# Altium schematic sheet DCCController.1.0.SchDoc
size A3
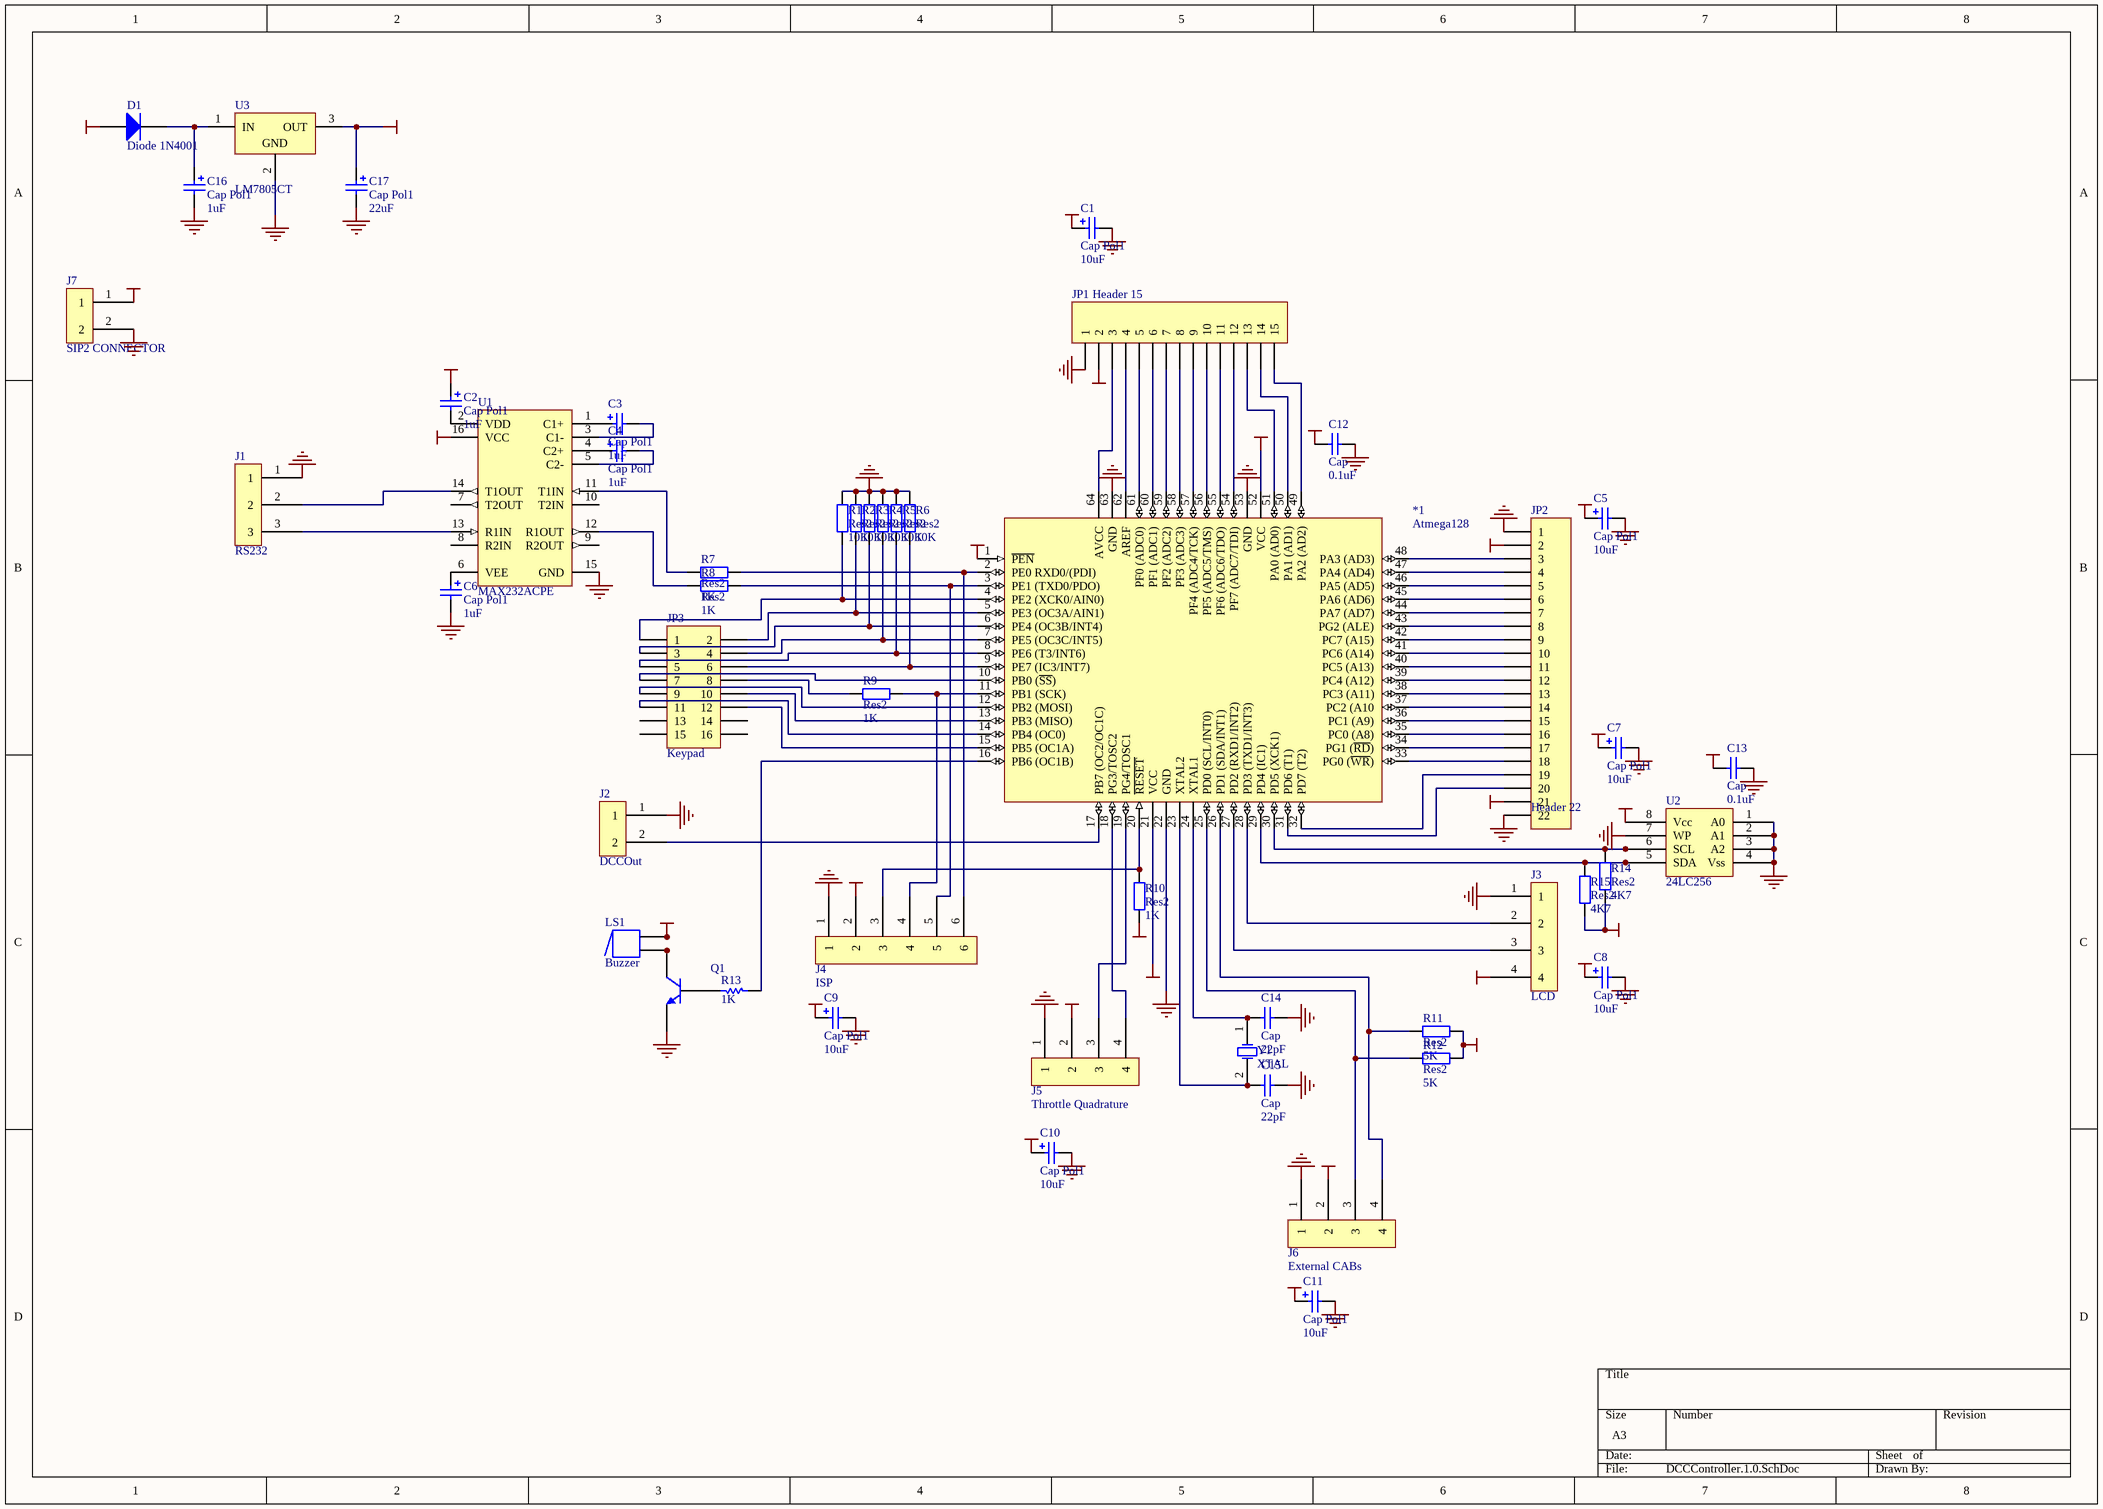
[diagram p0: DCCController.1.0.SchDoc]

## Parts
*1  Atmega128  [64A]
C1  Cap Pol1  value 10uF  [CC3216-1206]
C2  Cap Pol1  value 1uF  [CC3216-1206]
C3  Cap Pol1  value 1uF  [CC3216-1206]
C4  Cap Pol1  value 1uF  [CC3216-1206]
C5  Cap Pol1  value 10uF  [CC3216-1206]
C6  Cap Pol1  value 1uF  [CC3216-1206]
C7  Cap Pol1  value 10uF  [CC3216-1206]
C8  Cap Pol1  value 10uF  [CC3216-1206]
C9  Cap Pol1  value 10uF  [CC3216-1206]
C10  Cap Pol1  value 10uF  [CC3216-1206]
C11  Cap Pol1  value 10uF  [CC3216-1206]
C12  Cap  value 0.1uF  [RAD-0.1]
C13  Cap  value 0.1uF  [RAD-0.1]
C14  Cap  value 22pF  [CC2012-0805]
C15  Cap  value 22pF  [CC2012-0805]
C16  Cap Pol1  value 1uF  [CAPPR2-5X11]
C17  Cap Pol1  value 22uF  [CAPPR2.5-6.3X11.5]
D1  Diode 1N4001  [DIO10.46-5.3x2.8]
J1  RS232  [0.1 SIP 3 PIN]
J2  DCCOut  [0.1 SIP 2 PIN]
J3  LCD  [0.1 SIP 4 PIN]
J4  ISP  [0.1 SIP 6 PIN]
J5  Throttle Quadrature  [0.1 SIP 4 PIN]
J6  External CABs  [0.1 SIP 4 PIN]
J7  SIP2 CONNECTOR  [0.156 SIP 2 PIN]
JP1  Header 15  [HDR1X15]
JP2  Header 22  [HDR1X22]
JP3  Keypad  [HDR2X8]
LS1  Buzzer  [Mini PC Mount Piezo]
Q1  (no value)  [SO-G3]
R1  Res2  value 10K  [CR2012-0805]
R2  Res2  value 10K  [CR2012-0805]
R3  Res2  value 10K  [CR2012-0805]
R4  Res2  value 10K  [CR2012-0805]
R5  Res2  value 10K  [CR2012-0805]
R6  Res2  value 10K  [CR2012-0805]
R7  Res2  value 1K  [CR2012-0805]
R8  Res2  value 1K  [CR2012-0805]
R9  Res2  value 1K  [CR2012-0805]
R10  Res2  value 1K  [CR2012-0805]
R11  Res2  value 5K  [CR2012-0805]
R12  Res2  value 5K  [CR2012-0805]
R13  value 1K  [R2012-0805]  (hidden comment: Res1)
R14  Res2  value 4K7  [CR2012-0805]
R15  Res2  value 4K7  [CR2012-0805]
U1  MAX232ACPE  [PE16A]
U2  24LC256  [8P3]
U3  LM7805CT  [T03B]
Y1  XTAL  [Xtal Cylinder]

## Nets
GND: *1.22(GND) *1.53(GND) *1.63(GND) C1.2 C5.2 C6.2 C7.2 C8.2 C9.2 C10.2 C11.2 C12.2 C13.2 C14.2 C15.2 C16.2 C17.2 J1.1 J2.1 J3.1 J4.1 J5.1 J6.1 J7.2 JP1.1 JP2.1 JP2.22 Q1.2(E) R1.2 R2.2 R3.2 R4.2 R5.2 R6.2 U1.15(GND) U2.1(A0) U2.2(A1) U2.3(A2) U2.4(Vss) U2.7(WP) U3.2(GND)
VCC: *1.1(~{PEN}) *1.21(VCC) *1.52(VCC) C1.1 C2.1 C5.1 C7.1 C8.1 C9.1 C10.1 C11.1 C12.1 C13.1 C17.1 J3.4 J4.2 J5.2 J6.2 JP1.2 JP2.2 JP2.21 LS1.1 LS1.1A R10.1 R11.2 R12.2 R14.1 R15.1 U1.16(VCC) U2.8(Vcc) U3.3(OUT)
Vdd: D1.1(A) J7.1
Net*1_2: *1.2(PE0_RXD0/(PDI)) J4.6 R7.2
Net*1_3: *1.3(PE1_(TXD0/PDO)) J4.5 R8.2
Net*1_4: *1.4(PE2_(XCK0/AIN0)) JP3.1 R1.1
Net*1_5: *1.5(PE3_(OC3A/AIN1)) JP3.2 R2.1
Net*1_6: *1.6(PE4_(OC3B/INT4)) JP3.3 R3.1
Net*1_7: *1.7(PE5_(OC3C/INT5)) JP3.4 R4.1
Net*1_8: *1.8(PE6_(T3/INT6)) JP3.5 R5.1
Net*1_9: *1.9(PE7_(IC3/INT7)) JP3.6 R6.1
Net*1_10: *1.10(PB0_(~{SS})) JP3.7
Net*1_11: *1.11(PB1_(SCK)) J4.4 R9.2
Net*1_12: *1.12(PB2_(MOSI)) JP3.9
Net*1_13: *1.13(PB3_(MISO)) JP3.10
Net*1_14: *1.14(PB4_(OC0)) JP3.11
Net*1_15: *1.15(PB5_(OC1A)) JP3.12
Net*1_16: *1.16(PB6_(OC1B)) R13.1
Net*1_17: *1.17(PB7_(OC2/OC1C)) J2.2
Net*1_18: *1.18(PG3/TOSC2) J5.4
Net*1_19: *1.19(PG4/TOSC1) J5.3
Net*1_20: *1.20(~{RESET}) J4.3 R10.2
Net*1_23: *1.23(XTAL2) C15.1 Y1.2(OSC2)
Net*1_24: *1.24(XTAL1) C14.1 Y1.1(OSC1)
Net*1_25: *1.25(PD0_(SCL/INT0)) J6.3 R12.1
Net*1_26: *1.26(PD1_(SDA/INT1)) J6.4 R11.1
Net*1_27: *1.27(PD2_(RXD1/INT2)) J3.3
Net*1_28: *1.28(PD3_(TXD1/INT3)) J3.2
Net*1_29: *1.29(PD4_(IC1)) R15.2 U2.5(SDA)
Net*1_30: *1.30(PD5_(XCK1)) R14.2 U2.6(SCL)
Net*1_31: *1.31(PD6_(T1)) JP2.20
Net*1_32: *1.32(PD7_(T2)) JP2.19
Net*1_33: *1.33(PG0_(~{WR})) JP2.18
Net*1_34: *1.34(PG1_(~{RD})) JP2.17
Net*1_35: *1.35(PC0_(A8)) JP2.16
Net*1_36: *1.36(PC1_(A9)) JP2.15
Net*1_37: *1.37(PC2_(A10) JP2.14
Net*1_38: *1.38(PC3_(A11)) JP2.13
Net*1_39: *1.39(PC4_(A12)) JP2.12
Net*1_40: *1.40(PC5_(A13)) JP2.11
Net*1_41: *1.41(PC6_(A14)) JP2.10
Net*1_42: *1.42(PC7_(A15)) JP2.9
Net*1_43: *1.43(PG2_(ALE)) JP2.8
Net*1_44: *1.44(PA7_(AD7)) JP2.7
Net*1_45: *1.45(PA6_(AD6)) JP2.6
Net*1_46: *1.46(PA5_(AD5)) JP2.5
Net*1_47: *1.47(PA4_(AD4)) JP2.4
Net*1_48: *1.48(PA3_(AD3)) JP2.3
Net*1_49: *1.49(PA2_(AD2)) JP1.15
Net*1_50: *1.50(PA1_(AD1)) JP1.14
Net*1_51: *1.51(PA0_(AD0)) JP1.13
Net*1_54: *1.54(PF7_(ADC7/TDI)) JP1.12
Net*1_55: *1.55(PF6_(ADC6/TDO)) JP1.11
Net*1_56: *1.56(PF5_(ADC5/TMS)) JP1.10
Net*1_57: *1.57(PF4_(ADC4/TCK)) JP1.9
Net*1_58: *1.58(PF3_(ADC3)) JP1.8
Net*1_59: *1.59(PF2_(ADC2)) JP1.7
Net*1_60: *1.60(PF1_(ADC1)) JP1.6
Net*1_61: *1.61(PF0_(ADC0)) JP1.5
Net*1_62: *1.62(AREF) JP1.4
Net*1_64: *1.64(AVCC) JP1.3
NetC2_2: C2.2 U1.2(VDD)
NetC3_1: C3.1 U1.1(C1+)
NetC3_2: C3.2 U1.3(C1-)
NetC4_1: C4.1 U1.4(C2+)
NetC4_2: C4.2 U1.5(C2-)
NetC6_1: C6.1 U1.6(VEE)
NetC16_1: C16.1 D1.2(K) U3.1(IN)
NetJ1_2: J1.2 U1.14(T1OUT)
NetJ1_3: J1.3 U1.13(R1IN)
NetJP3_8: JP3.8 R9.1
NetLS1_2: LS1.2 LS1.2A Q1.3(C)
NetQ1_1: Q1.1(B) R13.2
NetR7_1: R7.1 U1.11(T1IN)
NetR8_1: R8.1 U1.12(R1OUT)

Not connected (* = marked no-connect by the designer): JP3 13 14 15 16; U1 7(T2OUT) 8(R2IN) 9(R2OUT) 10(T2IN)

## Library data of the parts
C1-C11 C16 C17 = Cap Pol1: Polarized Capacitor (Radial); Published: 8-Jun-2000; Revision: July-2002: Re-released for DXP Platform.; Publisher: Altium Limited
C12-C15 = Cap: Capacitor; Published: 8-Jun-2000; Revision: July-2002: Re-released for DXP Platform.; Publisher: Altium Limited
D1 = Diode 1N4001: 1 Amp General Purpose Rectifier; Revision 1: 11-Jul-2000: SIM Model Added.; Revision 2: 17-Jul-2002: Re-released for DXP Platform.; Package Information: Latest Revision: Aug-1999; Code - JEDEC: DO-204-AL; Published: 8-Jun-2000; Datasheet: Latest Revision: 1998; Package Reference: DO-41; Publisher: Altium Limited
J1 = SIP3 CONNECTOR
J2 = SIP2 CONNECTOR
J3 J5 J6 = SIP4 CONNECTOR
J4 = SIP6 CONNECTOR
JP1 = Header 15: Header, 15-Pin; Revision: 17-Jul-2002: Re-released for DXP Platform.; Publisher: Altium Limited
JP2 = Header 22: Header, 22-Pin; Revision: 17-Jul-2002: Re-released for DXP Platform.; Publisher: Altium Limited
JP3 = Header 8X2: Header, 8-Pin, Dual row; Revision: 17-Jul-2002: Re-released for DXP Platform.; Publisher: Altium Limited
LS1 = Buzzer: Magnetic Transducer Buzzer; Revision 1: Jul-2002: Re-released for DXP Platform.; Revision 2: 17-Dec-2003: Schematic revised, PCB Footprint replaced.; Published: 17-Dec-2003; Datasheet: Latest Revision: 17-Dec-2003; Publisher: Altium Limited
Q1 = MMBT100A: General Purpose Amplifier NPN Silicon; Package Information: Latest Revision: 1997; Published: 29-Sep-2000; Datasheet: Latest Revision: 1996; Package Reference: 318-08; Publisher: Altium Limited; Revision: 17-Jul-2002: Re-released for DXP Platform.
R1-R12 R14 R15 = Res2: Resistor; Published: 8-Jun-2000; Revision: July-2002: Re-released for DXP Platform.; Publisher: Altium Limited
R13 = Res1: Resistor; Published: 8-Jun-2000; Revision: July-2002: Re-released for DXP Platform.; Publisher: Altium Limited
U1 = MAX232ACPE: +5V Powered, Multi-Channel RS-232 Driver/Receiver; Package Information: Latest Revision: 1997; Code - JEDEC: MS-001-BB; Published: 16-Jan-2001; Revision: 17-Jul-2002: Re-released for DXP Platform.; Package Reference: PE16A; Publisher: Altium Limited
U3 = LM7805CT: Series 3-Terminal Positive Regulator; Package Information: Latest Revision: 1995; Note: Tab is connected to GND; Published: 15-Apr-2002; Datasheet: Latest Revision: May-1999; Package Reference: T03B; Publisher: Altium Limited
Y1 = XTAL: Crystal Oscillator; Published: 8-Jun-2000; Revision: July-2002: Re-released for DXP Platform.; Publisher: Altium Limited